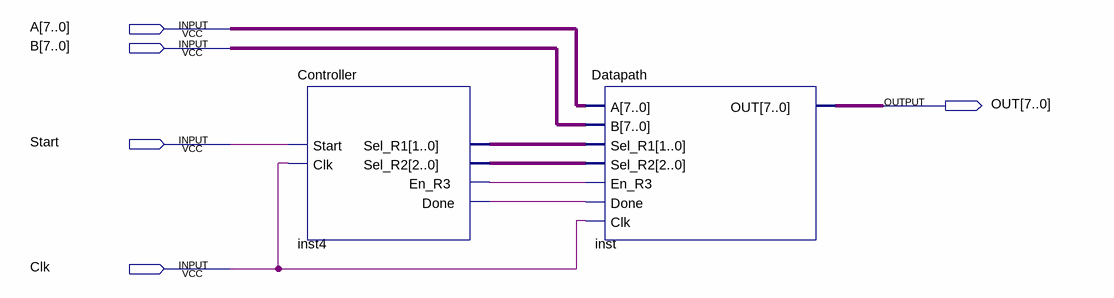
[diagram p0: schematic sheet]
// Quartus schematic Square-root_approximation.bdf as structural Verilog: 2 symbols, 5 pins
module \Square-root_approximation  (
  input  [7:0] A,
  input  [7:0] B,
  input  Start,
  input  Clk,
  output [7:0] OUT
);

  wire inst4_done, inst4_en_r3;
  wire [1:0] inst4_sel_r1;
  wire [2:0] inst4_sel_r2;

  Controller inst4 (
    .Start(Start), .Clk(Clk), .Sel_R1(inst4_sel_r1), .Sel_R2(inst4_sel_r2), .En_R3(inst4_en_r3),
    .Done(inst4_done));
  Datapath inst (
    .A(A), .B(B), .Sel_R1(inst4_sel_r1), .Sel_R2(inst4_sel_r2), .En_R3(inst4_en_r3), .Done(inst4_done),
    .Clk(Clk), .OUT(OUT));
endmodule
